# Altium project Oscilador.PrjPCB
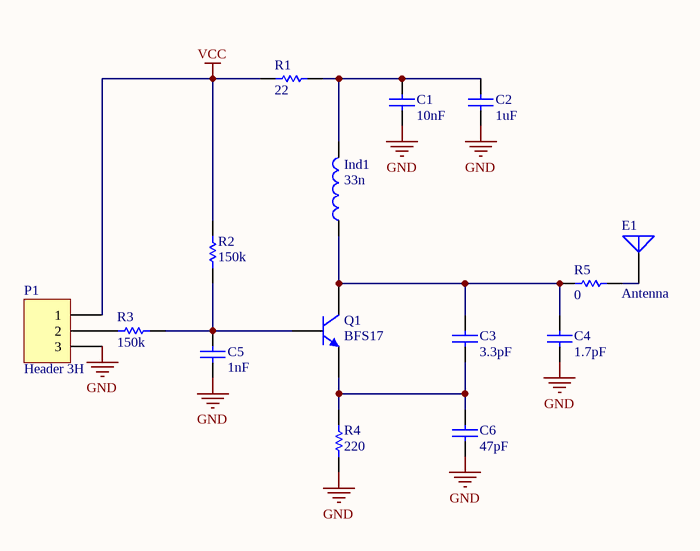
[diagram p0: Oscilador.SchDoc]
1 sheet, 15 parts. Net scope: global (net labels, ports and power ports of the same name join across sheets).
Board file: Oscilador.PcbDoc

## Sheet Oscilador.SchDoc
size A4

### Parts
C1  value 10nF  [0805_CAP]  (hidden comment: Capacitor)
C2  value 1uF  [0805_CAP]  (hidden comment: Capacitor)
C3  value 3.3pF  [0805_CAP]  (hidden comment: Capacitor)
C4  value 1.7pF  [0805_CAP]  (hidden comment: Capacitor)
C5  value 1nF  [0805_CAP]  (hidden comment: Capacitor)
C6  value 47pF  [0805_CAP]  (hidden comment: Capacitor)
E1  Antenna  [PIN1]
Ind1  Valor: 33n  [RES0603]  (hidden comment: Ind2)
P1  Header 3H  [HDR1X3H]
Q1  BFS17  [SOT23]
R1  value 22  [0805_RES]  (hidden comment: Resistor)
R2  value 150k  [0805_RES]  (hidden comment: Resistor)
R3  value 150k  [0805_RES]  (hidden comment: Resistor)
R4  value 220  [0805_RES]  (hidden comment: Resistor)
R5  value 0  [0805_RES]  (hidden comment: Resistor)

### Nets
GND: C1.1 C2.1 C4.1 C5.1 C6.1 P1.3 R4.2
VCC: P1.1 R1.1 R2.1
NetC1_2: C1.2 C2.2 Ind1.2 R1.2
NetC3_1: C3.1 C6.2 Q1.2(E) R4.1
NetC3_2: C3.2 C4.2 Ind1.1 Q1.3(C) R5.1
NetC5_2: C5.2 Q1.1(B) R2.2 R3.2
NetE1_1: E1.1(A) R5.2
NetP1_2: P1.2 R3.1

### Library data of the parts
C1-C6 = Cap
E1 = Antenna: Generic Antenna; Published: 24-Mar-1999; LatestRevisionDate: 17-Jul-2002; LatestRevisionNote: Re-released for DXP Platform.; PackageReference: PIN1; Publisher: Altium Limited
P1 = Header 3H: Header, 3-Pin, Right Angle; LatestRevisionDate: 17-Jul-2002; LatestRevisionNote: Re-released for DXP Platform.; Publisher: Altium Limited
Q1 = BFS17: NPN 1 GHz Wideband Transistor; Published: 17-Sep-2003; LatestRevisionDate: 12-Dec-2006; LatestRevisionNote: IPC-7351 Footprint Added.; DatasheetVersion: Sep-1995; PackageVersion: May-1999; PackageReference: SOT23; Publisher: Altium Limited; PackageDescription: 3-Pin SOT-23 Package 0.95 mm Pitch, 2.3 mm Lead Span; ComponentLink1Description: Manufacturer Link; ComponentLink1URL: http://www.semiconductors.philips.com/; ComponentLink2Description: Datasheet; ComponentLink2URL: http://www.semiconductors.philips.com/acrobat/datasheets/BFS17_2.pdf
R1-R5 = Res